# EAGLE board test (EAGLE 5.11)
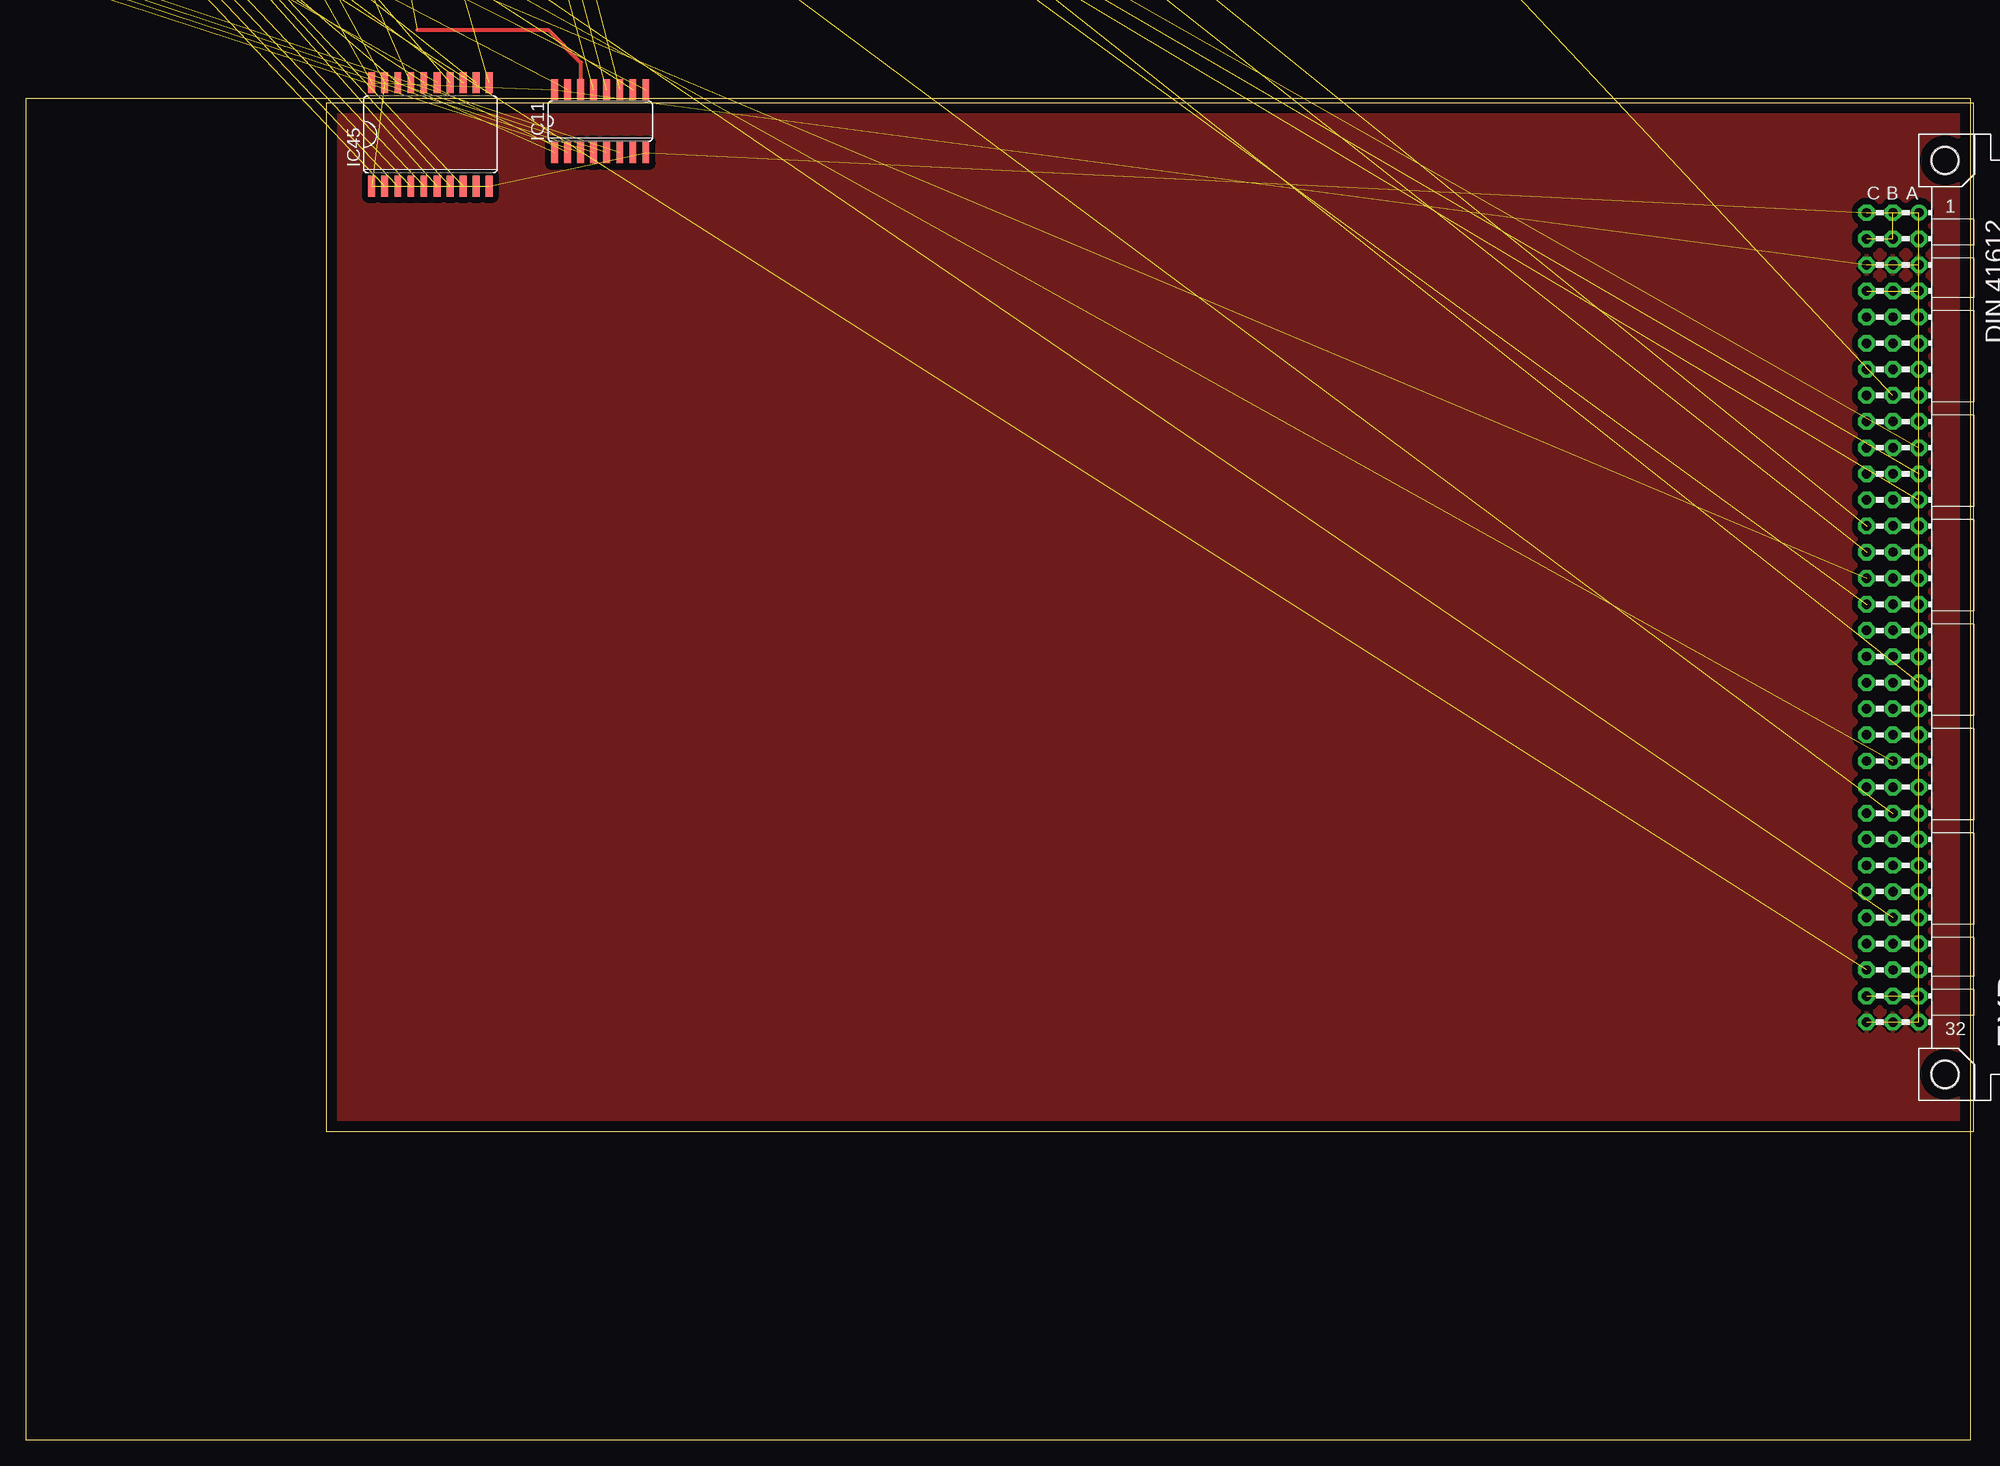
[diagram p10: board, top side]

Size 189.48 x 130.48 mm. Coordinates in mm from the lower left corner, seen from the top.
Outline: 0,0 189.21,0 189.21,130.48 0,130.48 0,0
Copper layers (1*16): Top 0.035mm / dielectric 1.5mm / Bottom 0.035mm
Design rules "default": minimum track width 10mil, minimum drill 24mil, track to track 8mil, track to pad 8mil, pad to pad 8mil, via to via 8mil, smd to smd 8mil, copper to edge 40mil, drill to drill 8mil, minimum pad ring 10mil, minimum via ring 8mil, stop-mask expansion 4mil, vias tented up to drill 0mil, thermal gap 10mil
Net classes: 0 default: width 0.305 mm, clearance 0.203 mm; 1 low power: width 1.27 mm, clearance 0.254 mm; 2 Power Rail: width 0.61 mm, clearance 0.152 mm

## Footprints (pad centres in the part's own frame; a part is rotated, then mirrored left to right if it is on the bottom)
C025-024X044 = drill 0.813 octagon: 1 -1.27,0; 2 1.27,0
E2,5-5 = drill 0.813 pad 1.6 round: + -1.27,0 | drill 0.813 pad 1.6 octagon: - 1.27,0
C0805K = smd 1.3 x 1.6: 1 -1,0; 2 1,0
2X3-NS = drill 1.016 pad 1.88 square: 1 -2.54,-1.27 | drill 1.016 pad 1.88 octagon: 2 -2.54,1.27; 3 0,-1.27; 4 0,1.27; 5 2.54,-1.27; 6 2.54,1.27
DO35-7 = drill 0.813 long: A 3.81,0; C -3.81,0
VG96K = drill 0.914 pad 1.6 round: A1 154.94,39.37 | drill 0.914 pad 1.6 octagon: A2 154.94,36.83; A3 154.94,34.29; A4 154.94,31.75; A5 154.94,29.21; A6 154.94,26.67; A7 154.94,24.13; A8 154.94,21.59; A9 154.94,19.05; A10 154.94,16.51; A11 154.94,13.97; A12 154.94,11.43; A13 154.94,8.89; A14 154.94,6.35; A15 154.94,3.81; A16 154.94,1.27; A17 154.94,-1.27; A18 154.94,-3.81; A19 154.94,-6.35; A20 154.94,-8.89; A21 154.94,-11.43; A22 154.94,-13.97; A23 154.94,-16.51; A24 154.94,-19.05; A25 154.94,-21.59; A26 154.94,-24.13; A27 154.94,-26.67; A28 154.94,-29.21; A29 154.94,-31.75; A30 154.94,-34.29; A31 154.94,-36.83; A32 154.94,-39.37; B1 152.4,39.37; B2 152.4,36.83; B3 152.4,34.29; B4 152.4,31.75; B5 152.4,29.21; B6 152.4,26.67; B7 152.4,24.13; B8 152.4,21.59; B9 152.4,19.05; B10 152.4,16.51; B11 152.4,13.97; B12 152.4,11.43; B13 152.4,8.89; B14 152.4,6.35; B15 152.4,3.81; B16 152.4,1.27; B17 152.4,-1.27; B18 152.4,-3.81; B19 152.4,-6.35; B20 152.4,-8.89; B21 152.4,-11.43; B22 152.4,-13.97; B23 152.4,-16.51; B24 152.4,-19.05; B25 152.4,-21.59; B26 152.4,-24.13; B27 152.4,-26.67; B28 152.4,-29.21; B29 152.4,-31.75; B30 152.4,-34.29; B31 152.4,-36.83; B32 152.4,-39.37; C1 149.86,39.37; C2 149.86,36.83; C3 149.86,34.29; C4 149.86,31.75; C5 149.86,29.21; C6 149.86,26.67; C7 149.86,24.13; C8 149.86,21.59; C9 149.86,19.05; C10 149.86,16.51; C11 149.86,13.97; C12 149.86,11.43; C13 149.86,8.89; C14 149.86,6.35; C15 149.86,3.81; C16 149.86,1.27; C17 149.86,-1.27; C18 149.86,-3.81; C19 149.86,-6.35; C20 149.86,-8.89; C21 149.86,-11.43; C22 149.86,-13.97; C23 149.86,-16.51; C24 149.86,-19.05; C25 149.86,-21.59; C26 149.86,-24.13; C27 149.86,-26.67; C28 149.86,-29.21; C29 149.86,-31.75; C30 149.86,-34.29; C31 149.86,-36.83; C32 149.86,-39.37 | hole 2.794: 157.48,44.45; 157.48,-44.45
SO16 = smd 0.66 x 2.032: 1 -4.445,-3.073; 2 -3.175,-3.073; 3 -1.905,-3.073; 4 -0.635,-3.073; 5 0.635,-3.073; 6 1.905,-3.073; 7 3.175,-3.073; 8 4.445,-3.073; 9 4.445,3.073; 10 3.175,3.073; 11 1.905,3.073; 12 0.635,3.073; 13 -0.635,3.073; 14 -1.905,3.073; 15 -3.175,3.073; 16 -4.445,3.073
SO20W = smd 0.66 x 2.032: 1 -5.715,-5.029; 2 -4.445,-5.029; 3 -3.175,-5.029; 4 -1.905,-5.029; 5 -0.635,-5.029; 6 0.635,-5.029; 7 1.905,-5.029; 8 3.175,-5.029; 9 4.445,-5.029; 10 5.715,-5.029; 11 5.715,5.029; 12 4.445,5.029; 13 3.175,5.029; 14 1.905,5.029; 15 0.635,5.029; 16 -0.635,5.029; 17 -1.905,5.029; 18 -3.175,5.029; 19 -4.445,5.029; 20 -5.715,5.029
SO14 = smd 0.66 x 2.032: 1 -3.81,-3.073; 2 -2.54,-3.073; 3 -1.27,-3.073; 4 0,-3.073; 5 1.27,-3.073; 6 2.54,-3.073; 7 3.81,-3.073; 8 3.81,3.073; 9 2.54,3.073; 10 1.27,3.073; 11 0,3.073; 12 -1.27,3.073; 13 -2.54,3.073; 14 -3.81,3.073
DIL28-3 = drill 0.813 long: 1 -16.51,-3.81; 2 -13.97,-3.81; 3 -11.43,-3.81; 4 -8.89,-3.81; 5 -6.35,-3.81; 6 -3.81,-3.81; 7 -1.27,-3.81; 8 1.27,-3.81; 9 3.81,-3.81; 10 6.35,-3.81; 11 8.89,-3.81; 12 11.43,-3.81; 13 13.97,-3.81; 14 16.51,-3.81; 15 16.51,3.81; 16 13.97,3.81; 17 11.43,3.81; 18 8.89,3.81; 19 6.35,3.81; 20 3.81,3.81; 21 1.27,3.81; 22 -1.27,3.81; 23 -3.81,3.81; 24 -6.35,3.81; 25 -8.89,3.81; 26 -11.43,3.81; 27 -13.97,3.81; 28 -16.51,3.81
MA06-1 = drill 1.016 long: 1 -6.35,0; 2 -3.81,0; 3 -1.27,0; 4 1.27,0; 5 3.81,0; 6 6.35,0
JP2 = drill 0.914 long: 1 -2.54,0; 2 0,0; 3 2.54,0
2,54/1,0 = drill 1.016 pad 2.54 octagon: 1 0,0
PAK100/2500-40 = drill 1 pad 1.422 round: 1 -24.13,-1.27; 2 -24.13,1.27; 3 -21.59,-1.27; 4 -21.59,1.27; 5 -19.05,-1.27; 6 -19.05,1.27; 7 -16.51,-1.27; 8 -16.51,1.27; 9 -13.97,-1.27; 10 -13.97,1.27; 11 -11.43,-1.27; 12 -11.43,1.27; 13 -8.89,-1.27; 14 -8.89,1.27; 15 -6.35,-1.27; 16 -6.35,1.27; 17 -3.81,-1.27; 18 -3.81,1.27; 19 -1.27,-1.27; 20 -1.27,1.27; 21 1.27,-1.27; 22 1.27,1.27; 23 3.81,-1.27; 24 3.81,1.27; 25 6.35,-1.27; 26 6.35,1.27; 27 8.89,-1.27; 28 8.89,1.27; 29 11.43,-1.27; 30 11.43,1.27; 31 13.97,-1.27; 32 13.97,1.27; 33 16.51,-1.27; 34 16.51,1.27; 35 19.05,-1.27; 36 19.05,1.27; 37 21.59,-1.27; 38 21.59,1.27; 39 24.13,-1.27; 40 24.13,1.27
MA05-1 = drill 1.016 long: 1 -5.08,0; 2 -2.54,0; 3 0,0; 4 2.54,0; 5 5.08,0
057-020-1 = drill 1 octagon: 1 -11.43,-1.27; 2 -11.43,1.27; 3 -8.89,-1.27; 4 -8.89,1.27; 5 -6.35,-1.27; 6 -6.35,1.27; 7 -3.81,-1.27; 8 -3.81,1.27; 9 -1.27,-1.27; 10 -1.27,1.27; 11 1.27,-1.27; 12 1.27,1.27; 13 3.81,-1.27; 14 3.81,1.27; 15 6.35,-1.27; 16 6.35,1.27; 17 8.89,-1.27; 18 8.89,1.27; 19 11.43,-1.27; 20 11.43,1.27
PAK100/2500-50 = drill 1 pad 1.422 round: 1 -30.48,-1.27; 2 -30.48,1.27; 3 -27.94,-1.27; 4 -27.94,1.27; 5 -25.4,-1.27; 6 -25.4,1.27; 7 -22.86,-1.27; 8 -22.86,1.27; 9 -20.32,-1.27; 10 -20.32,1.27; 11 -17.78,-1.27; 12 -17.78,1.27; 13 -15.24,-1.27; 14 -15.24,1.27; 15 -12.7,-1.27; 16 -12.7,1.27; 17 -10.16,-1.27; 18 -10.16,1.27; 19 -7.62,-1.27; 20 -7.62,1.27; 21 -5.08,-1.27; 22 -5.08,1.27; 23 -2.54,-1.27; 24 -2.54,1.27; 25 0,-1.27; 26 0,1.27; 27 2.54,-1.27; 28 2.54,1.27; 29 5.08,-1.27; 30 5.08,1.27; 31 7.62,-1.27; 32 7.62,1.27; 33 10.16,-1.27; 34 10.16,1.27; 35 12.7,-1.27; 36 12.7,1.27; 37 15.24,-1.27; 38 15.24,1.27; 39 17.78,-1.27; 40 17.78,1.27; 41 20.32,-1.27; 42 20.32,1.27; 43 22.86,-1.27; 44 22.86,1.27; 45 25.4,-1.27; 46 25.4,1.27; 47 27.94,-1.27; 48 27.94,1.27; 49 30.48,-1.27; 50 30.48,1.27
QS = drill 0.61 long: 1 -2.54,0; 2 2.54,0
0204/7 = drill 0.813 octagon: 1 -3.81,0; 2 3.81,0
SIL9 = drill 0.813 long: 1 -10.16,0; 2 -7.62,0; 3 -5.08,0; 4 -2.54,0; 5 0,0; 6 2.54,0; 7 5.08,0; 8 7.62,0; 9 10.16,0
SIL5 = drill 0.813 long: 1 -5.08,0; 2 -2.54,0; 3 0,0; 4 2.54,0; 5 5.08,0
SIL4 = drill 0.813 long: 1 -3.81,0; 2 -1.27,0; 3 1.27,0; 4 3.81,0
EDG-08 = drill 0.813 long: 1 -8.89,-3.81; 2 -6.35,-3.81; 3 -3.81,-3.81; 4 -1.27,-3.81; 5 1.27,-3.81; 6 3.81,-3.81; 7 6.35,-3.81; 8 8.89,-3.81; 9 8.89,3.81; 10 6.35,3.81; 11 3.81,3.81; 12 1.27,3.81; 13 -1.27,3.81; 14 -3.81,3.81; 15 -6.35,3.81; 16 -8.89,3.81
EDG-04 = drill 0.813 long: 1 -3.81,-3.81; 2 -1.27,-3.81; 3 1.27,-3.81; 4 3.81,-3.81; 5 3.81,3.81; 6 1.27,3.81; 7 -1.27,3.81; 8 -3.81,3.81
EDG-03 = drill 0.813 long: 1 -2.54,-3.81; 2 0,-3.81; 3 2.54,-3.81; 4 2.54,3.81; 5 0,3.81; 6 -2.54,3.81
STANDOFF_28_60 = hole 3.302: 0,0
PAK100/2500-34 = drill 1 pad 1.422 round: 1 -20.32,-1.27; 2 -20.32,1.27; 3 -17.78,-1.27; 4 -17.78,1.27; 5 -15.24,-1.27; 6 -15.24,1.27; 7 -12.7,-1.27; 8 -12.7,1.27; 9 -10.16,-1.27; 10 -10.16,1.27; 11 -7.62,-1.27; 12 -7.62,1.27; 13 -5.08,-1.27; 14 -5.08,1.27; 15 -2.54,-1.27; 16 -2.54,1.27; 17 0,-1.27; 18 0,1.27; 19 2.54,-1.27; 20 2.54,1.27; 21 5.08,-1.27; 22 5.08,1.27; 23 7.62,-1.27; 24 7.62,1.27; 25 10.16,-1.27; 26 10.16,1.27; 27 12.7,-1.27; 28 12.7,1.27; 29 15.24,-1.27; 30 15.24,1.27; 31 17.78,-1.27; 32 17.78,1.27; 33 20.32,-1.27; 34 20.32,1.27
PAK100/2500-5-40 = drill 1 pad 1.422 round: 1 -24.13,-1.27; 2 -24.13,1.27; 3 -21.59,-1.27; 4 -21.59,1.27; 5 -19.05,-1.27; 6 -19.05,1.27; 7 -16.51,-1.27; 8 -16.51,1.27; 9 -13.97,-1.27; 10 -13.97,1.27; 11 -11.43,-1.27; 12 -11.43,1.27; 13 -8.89,-1.27; 14 -8.89,1.27; 15 -6.35,-1.27; 16 -6.35,1.27; 17 -3.81,-1.27; 18 -3.81,1.27; 19 -1.27,-1.27; 20 -1.27,1.27; 21 1.27,-1.27; 22 1.27,1.27; 23 3.81,-1.27; 24 3.81,1.27; 25 6.35,-1.27; 26 6.35,1.27; 27 8.89,-1.27; 28 8.89,1.27; 29 11.43,-1.27; 30 11.43,1.27; 31 13.97,-1.27; 32 13.97,1.27; 33 16.51,-1.27; 34 16.51,1.27; 35 19.05,-1.27; 36 19.05,1.27; 37 21.59,-1.27; 38 21.59,1.27; 39 24.13,-1.27; 40 24.13,1.27

## Placement (x,y rotation side)
$4_37_$  SIGNATURESILK  [SIGNATURE]  -163.83,260.35 0 top  (outside the outline)
$4_39_$  OSHW-LOGOL  [OSHW-LOGO-L]  -86.36,274.32 0 top  (outside the outline)
$4_40_$  QRCODE-CFT  [CFT-QRCODE]  -184.15,31.75 0 top  (outside the outline)
C1  0.1uF  [C025-024X044]  -93.98,274.32 0 top  (outside the outline)
C2  0.1uF  [C025-024X044]  -100.33,274.32 0 top  (outside the outline)
C3  0.1uF  [C025-024X044]  -106.68,274.32 0 top  (outside the outline)
C4  0.1uF  [C025-024X044]  -113.03,274.32 0 top  (outside the outline)
C5  0.1uF  [C025-024X044]  -119.38,274.32 0 top  (outside the outline)
C6  0.1uF  [C025-024X044]  -125.73,274.32 0 top  (outside the outline)
C7  0.1uF  [C025-024X044]  -132.08,274.32 0 top  (outside the outline)
C8  1uF  [C025-024X044]  -170.18,281.94 0 top  (outside the outline)
C9  0.1uF  [C025-024X044]  -138.43,274.32 0 top  (outside the outline)
C10  0.1uF  [C025-024X044]  -144.78,274.32 0 top  (outside the outline)
C11  0.1uF  [C025-024X044]  -151.13,274.32 0 top  (outside the outline)
C12  0.1uF  [C025-024X044]  -157.48,274.32 0 top  (outside the outline)
C17  0.1uF  [C025-024X044]  -163.83,274.32 0 top  (outside the outline)
C18  0.1uF  [C025-024X044]  -170.18,274.32 0 top  (outside the outline)
C19  1uF  [C025-024X044]  -175.26,281.94 0 top  (outside the outline)
C20  0.1uF  [C025-024X044]  -176.53,274.32 0 top  (outside the outline)
C21  0.1uF  [C025-024X044]  -182.88,274.32 0 top  (outside the outline)
C22  0.1uF  [C025-024X044]  -189.23,274.32 0 top  (outside the outline)
C23  0.1uF  [C025-024X044]  -195.58,274.32 0 top  (outside the outline)
C24  0.1uF  [C025-024X044]  -201.93,274.32 0 top  (outside the outline)
C25  0.1uF  [C025-024X044]  -208.28,274.32 0 top  (outside the outline)
C26  0.1uF  [C025-024X044]  -214.63,274.32 0 top  (outside the outline)
C27  0.1uF  [C025-024X044]  12.7,281.94 0 top  (outside the outline)
C28  0.1uF  [C025-024X044]  6.35,281.94 0 top  (outside the outline)
C29  0.1uF  [C025-024X044]  0,281.94 0 top  (outside the outline)
C30  1uF  [C025-024X044]  -180.34,281.94 0 top  (outside the outline)
C31  0.1uF  [C025-024X044]  -6.35,281.94 0 top  (outside the outline)
C32  0.1uF  [C025-024X044]  -12.7,281.94 0 top  (outside the outline)
C33  0.1uF  [C025-024X044]  -19.05,281.94 0 top  (outside the outline)
C34  0.1uF  [C025-024X044]  -25.4,281.94 0 top  (outside the outline)
C35  0.1uF  [C025-024X044]  -31.75,281.94 0 top  (outside the outline)
C36  0.1uF  [C025-024X044]  -38.1,281.94 0 top  (outside the outline)
C37  0.1uF  [C025-024X044]  -44.45,281.94 0 top  (outside the outline)
C38  0.1uF  [C025-024X044]  -50.8,281.94 0 top  (outside the outline)
C39  0.1uF  [C025-024X044]  -57.15,281.94 0 top  (outside the outline)
C40  0.1uF  [C025-024X044]  -63.5,281.94 0 top  (outside the outline)
C41  0.1uF  [C025-024X044]  -69.85,281.94 0 top  (outside the outline)
C42  1uF  [C025-024X044]  -185.42,281.94 0 top  (outside the outline)
C43  0.1uF  [C025-024X044]  -76.2,281.94 0 top  (outside the outline)
C44  0.1uF  [C025-024X044]  -82.55,281.94 0 top  (outside the outline)
C45  0.1uF  [C025-024X044]  -88.9,281.94 0 top  (outside the outline)
C46  1uF  [C025-024X044]  -190.5,281.94 0 top  (outside the outline)
C47  0.1uF  [C025-024X044]  -95.25,281.94 0 top  (outside the outline)
C48  0.1uF  [C025-024X044]  -101.6,281.94 0 top  (outside the outline)
C49  22pF  [C025-024X044]  -158.75,281.94 0 top  (outside the outline)
C50  22pF  [C025-024X044]  -165.1,281.94 0 top  (outside the outline)
C51  0.1uF  [C025-024X044]  -107.95,281.94 0 top  (outside the outline)
C52  0.1uF  [C025-024X044]  -114.3,281.94 0 top  (outside the outline)
C53  0.1uF  [C025-024X044]  -120.65,281.94 0 top  (outside the outline)
C54  1uF  [C025-024X044]  -195.58,281.94 0 top  (outside the outline)
C55  0.1uF  [C025-024X044]  -127,281.94 0 top  (outside the outline)
C56  0.1uF  [C025-024X044]  -133.35,281.94 0 top  (outside the outline)
C57  0.1uF  [C025-024X044]  -139.7,281.94 0 top  (outside the outline)
C58  0.1uF  [C025-024X044]  -146.05,281.94 0 top  (outside the outline)
C59  0.1uF  [C025-024X044]  -152.4,281.94 0 top  (outside the outline)
C60  100uF  [E2,5-5]  -176.53,288.29 0 top  (outside the outline)
C61  1uF  [C0805K]  -115.57,300.99 0 top  (outside the outline)
C62  1uF  [C0805K]  -120.65,300.99 0 top  (outside the outline)
C63  47uF  [E2,5-5]  -186.69,288.29 0 top  (outside the outline)
C64  47uF  [E2,5-5]  -196.85,288.29 0 top  (outside the outline)
CON1  [2X3-NS]  -168.91,262.89 0 top  (outside the outline)
D3  1N4148  [DO35-7]  2.54,288.29 0 top  (outside the outline)
D4  1N4148  [DO35-7]  -10.16,288.29 0 top  (outside the outline)
D5  1N4148  [DO35-7]  -22.86,288.29 0 top  (outside the outline)
D6  1N4148  [DO35-7]  -35.56,288.29 0 top  (outside the outline)
D7  1N4148  [DO35-7]  -48.26,288.29 0 top  (outside the outline)
D16  1N4148  [DO35-7]  -60.96,288.29 0 top  (outside the outline)
D17  1N4148  [DO35-7]  -73.66,288.29 0 top  (outside the outline)
D22  1N4148  [DO35-7]  -86.36,288.29 0 top  (outside the outline)
D23  1N4148  [DO35-7]  -99.06,288.29 0 top  (outside the outline)
D24  1N4148  [DO35-7]  -111.76,288.29 0 top  (outside the outline)
D25  1N4148  [DO35-7]  -124.46,288.29 0 top  (outside the outline)
D26  1N4148  [DO35-7]  -137.16,288.29 0 top  (outside the outline)
D31  1N4148  [DO35-7]  -149.86,288.29 0 top  (outside the outline)
D32  1N4148  [DO35-7]  -162.56,288.29 0 top  (outside the outline)
EXP  [VG96K]  29.21,80.01 0 top
IC1  74HC138D  [SO16]  -162.56,191.77 0 top  (outside the outline)
IC2  74HC541DW  [SO20W]  -179.07,175.26 0 top  (outside the outline)
IC3  74HC541DW  [SO20W]  2.54,191.77 0 top  (outside the outline)
IC4  74HC541DW  [SO20W]  -25.4,191.77 0 top  (outside the outline)
IC5  74HC541DW  [SO20W]  -53.34,191.77 0 top  (outside the outline)
IC6  74HC165D  [SO16]  -185.42,191.77 0 top  (outside the outline)
IC7  74HC165D  [SO16]  5.08,204.47 0 top  (outside the outline)
IC8  74HC165D  [SO16]  -17.78,204.47 0 top  (outside the outline)
IC9  74HC165D  [SO16]  -40.64,204.47 0 top  (outside the outline)
IC10  74HC165D  [SO16]  -63.5,204.47 0 top  (outside the outline)
IC11  74HC165D  [SO16]  55.88,128.27 0 top
IC12  74HC595D  [SO16]  -109.22,204.47 0 top  (outside the outline)
IC13  74HC112D  [SO16]  -132.08,204.47 0 top  (outside the outline)
IC16  74HC165D  [SO16]  -154.94,204.47 0 top  (outside the outline)
IC17  74HC165D  [SO16]  -177.8,204.47 0 top  (outside the outline)
IC18  74HC165D  [SO16]  -200.66,204.47 0 top  (outside the outline)
IC19  74HC165D  [SO16]  5.08,217.17 0 top  (outside the outline)
IC20  74HC165D  [SO16]  -17.78,217.17 0 top  (outside the outline)
IC21  74HC165D  [SO16]  -40.64,217.17 0 top  (outside the outline)
IC22  74HC165D  [SO16]  -63.5,217.17 0 top  (outside the outline)
IC23  74HC165D  [SO16]  -86.36,217.17 0 top  (outside the outline)
IC24  74HC165D  [SO16]  -109.22,217.17 0 top  (outside the outline)
IC25  74HC165D  [SO16]  -132.08,217.17 0 top  (outside the outline)
IC32  74HC595D  [SO16]  -154.94,217.17 0 top  (outside the outline)
IC33  74HC595D  [SO16]  -177.8,217.17 0 top  (outside the outline)
IC35  74HC595D  [SO16]  -200.66,217.17 0 top  (outside the outline)
IC37  74HC85D  [SO16]  5.08,229.87 0 top  (outside the outline)
IC38  74HC74D  [SO14]  -85.09,229.87 0 top  (outside the outline)
IC39  74HC74D  [SO14]  -105.41,229.87 0 top  (outside the outline)
IC40  74HC253D  [SO16]  -17.78,229.87 0 top  (outside the outline)
IC41  MEGA168  [DIL28-3]  -143.51,175.26 0 top  (outside the outline)
IC42  74HC138D  [SO16]  -40.64,229.87 0 top  (outside the outline)
IC43  74HC259D  [SO16]  -63.5,229.87 0 top  (outside the outline)
IC45  74HC540DW  [SO20W]  39.37,127 0 top
IC47  74HC540DW  [SO20W]  -109.22,191.77 0 top  (outside the outline)
IC48  74HC540DW  [SO20W]  -137.16,191.77 0 top  (outside the outline)
JP1  [MA06-1]  -181.61,262.89 0 top  (outside the outline)
JP26  [JP2]  11.43,274.32 0 top  (outside the outline)
JP27  [JP2]  2.54,274.32 0 top  (outside the outline)
JP28  [JP2]  -6.35,274.32 0 top  (outside the outline)
JP29  [JP2]  -15.24,274.32 0 top  (outside the outline)
JP30  [JP2]  -24.13,274.32 0 top  (outside the outline)
JP31  [JP2]  -33.02,274.32 0 top  (outside the outline)
JP32  [JP2]  -41.91,274.32 0 top  (outside the outline)
JP33  [JP2]  -50.8,274.32 0 top  (outside the outline)
JP34  [JP2]  -59.69,274.32 0 top  (outside the outline)
JP35  [JP2]  -68.58,274.32 0 top  (outside the outline)
JP36  [JP2]  -77.47,274.32 0 top  (outside the outline)
NC1  [2,54/1,0]  0,304.8 0 top  (outside the outline)
NC4  [2,54/1,0]  -5.08,304.8 0 top  (outside the outline)
NC9  [2,54/1,0]  -10.16,304.8 0 top  (outside the outline)
NC10  [2,54/1,0]  -127,299.72 0 top  (outside the outline)
NC11  [2,54/1,0]  -133.35,299.72 0 top  (outside the outline)
NC12  [2,54/1,0]  -139.7,299.72 0 top  (outside the outline)
NC13  [2,54/1,0]  -146.05,299.72 0 top  (outside the outline)
NC14  [2,54/1,0]  -152.4,299.72 0 top  (outside the outline)
NC15  [2,54/1,0]  -158.75,299.72 0 top  (outside the outline)
NC16  [2,54/1,0]  -165.1,299.72 0 top  (outside the outline)
NC17  [2,54/1,0]  -171.45,299.72 0 top  (outside the outline)
NC18  [2,54/1,0]  -177.8,299.72 0 top  (outside the outline)
NC19  [2,54/1,0]  -184.15,299.72 0 top  (outside the outline)
NC20  [2,54/1,0]  -190.5,299.72 0 top  (outside the outline)
NC21  [2,54/1,0]  -196.85,299.72 0 top  (outside the outline)
NC22  [2,54/1,0]  -203.2,299.72 0 top  (outside the outline)
NC23  [2,54/1,0]  -209.55,299.72 0 top  (outside the outline)
NC24  [2,54/1,0]  -215.9,299.72 0 top  (outside the outline)
NC25  [2,54/1,0]  11.43,304.8 0 top  (outside the outline)
NC26  [2,54/1,0]  5.08,304.8 0 top  (outside the outline)
P4  2540-  [PAK100/2500-40]  -85.09,252.73 0 top  (outside the outline)
P5  2540-  [PAK100/2500-40]  -144.78,252.73 0 top  (outside the outline)
P6  2540-  [PAK100/2500-40]  -12.7,264.16 0 top  (outside the outline)
P7  2540-  [PAK100/2500-40]  -72.39,264.16 0 top  (outside the outline)
P8  [MA05-1]  -196.85,262.89 0 top  (outside the outline)
P9  057-020-1  [057-020-1]  -59.69,176.53 0 top  (outside the outline)
P10  2550-  [PAK100/2500-50]  -152.4,228.6 0 top  (outside the outline)
P11  2550-  [PAK100/2500-50]  -19.05,241.3 0 top  (outside the outline)
P12  2550-  [PAK100/2500-50]  -91.44,241.3 0 top  (outside the outline)
P13  2550-  [PAK100/2500-50]  -163.83,241.3 0 top  (outside the outline)
P14  2550-  [PAK100/2500-50]  -19.05,252.73 0 top  (outside the outline)
Q2  [QS]  -209.55,261.62 0 top  (outside the outline)
R1  30R  [0204/7]  -17.78,304.8 0 top  (outside the outline)
R2  30R  [0204/7]  -27.94,304.8 0 top  (outside the outline)
R3  4k7  [0204/7]  -38.1,304.8 0 top  (outside the outline)
R4  4k7  [0204/7]  -48.26,304.8 0 top  (outside the outline)
R5  4k7  [0204/7]  -58.42,304.8 0 top  (outside the outline)
R6  4k7  [0204/7]  -68.58,304.8 0 top  (outside the outline)
R7  30R  [0204/7]  -78.74,304.8 0 top  (outside the outline)
R8  4k7  [0204/7]  -88.9,304.8 0 top  (outside the outline)
R9  30R  [0204/7]  -99.06,304.8 0 top  (outside the outline)
R10  30R  [0204/7]  -109.22,304.8 0 top  (outside the outline)
R11  30R  [0204/7]  -119.38,304.8 0 top  (outside the outline)
R12  30R  [0204/7]  -129.54,304.8 0 top  (outside the outline)
R13  30R  [0204/7]  -139.7,304.8 0 top  (outside the outline)
R14  30R  [0204/7]  -149.86,304.8 0 top  (outside the outline)
R15  30R  [0204/7]  -160.02,304.8 0 top  (outside the outline)
R16  30R  [0204/7]  -170.18,304.8 0 top  (outside the outline)
R17  30R  [0204/7]  -180.34,304.8 0 top  (outside the outline)
R18  30R  [0204/7]  -190.5,304.8 0 top  (outside the outline)
R19  30R  [0204/7]  -200.66,304.8 0 top  (outside the outline)
R20  30R  [0204/7]  -210.82,304.8 0 top  (outside the outline)
R21  30R  [0204/7]  11.43,309.88 0 top  (outside the outline)
R22  4k7  [0204/7]  1.27,309.88 0 top  (outside the outline)
R23  30R  [0204/7]  -8.89,309.88 0 top  (outside the outline)
R24  30R  [0204/7]  -19.05,309.88 0 top  (outside the outline)
R25  30R  [0204/7]  -29.21,309.88 0 top  (outside the outline)
R26  30R  [0204/7]  -39.37,309.88 0 top  (outside the outline)
R27  30R  [0204/7]  -49.53,309.88 0 top  (outside the outline)
R28  30R  [0204/7]  -59.69,309.88 0 top  (outside the outline)
R29  30R  [0204/7]  -69.85,309.88 0 top  (outside the outline)
R30  30R  [0204/7]  -80.01,309.88 0 top  (outside the outline)
R31  30R  [0204/7]  -90.17,309.88 0 top  (outside the outline)
R32  30R  [0204/7]  -100.33,309.88 0 top  (outside the outline)
R33  30R  [0204/7]  -110.49,309.88 0 top  (outside the outline)
R37  30R  [0204/7]  -120.65,309.88 0 top  (outside the outline)
R38  30R  [0204/7]  -130.81,309.88 0 top  (outside the outline)
RN1  4k7  [SIL9]  3.81,294.64 0 top  (outside the outline)
RN2  4k7  [SIL9]  -21.59,294.64 0 top  (outside the outline)
RN3  4k7  [SIL9]  -46.99,294.64 0 top  (outside the outline)
RN4  4k7  [SIL9]  -72.39,294.64 0 top  (outside the outline)
RN5  4k7  [SIL9]  -97.79,294.64 0 top  (outside the outline)
RN6  4k7  [SIL9]  -123.19,294.64 0 top  (outside the outline)
RN7  4k7  [SIL9]  -148.59,294.64 0 top  (outside the outline)
RN9  4k7  [SIL9]  -173.99,294.64 0 top  (outside the outline)
RN10  4k7  [SIL9]  -199.39,294.64 0 top  (outside the outline)
RN11  4k7  [SIL5]  -92.71,299.72 0 top  (outside the outline)
RN13  4k7  [SIL9]  3.81,299.72 0 top  (outside the outline)
RN14  4k7  [SIL9]  -21.59,299.72 0 top  (outside the outline)
RN18  4k7  [SIL4]  -106.68,299.72 0 top  (outside the outline)
RN19  4k7  [SIL9]  -46.99,299.72 0 top  (outside the outline)
RN20  4k7  [SIL9]  -72.39,299.72 0 top  (outside the outline)
SW1  [EDG-08]  -88.9,175.26 0 top  (outside the outline)
SW2  [EDG-04]  -107.95,175.26 0 top  (outside the outline)
SW3  [EDG-03]  -119.38,175.26 0 top  (outside the outline)
U1  HOLE  [STANDOFF_28_60]  -201.93,281.94 0 top  (outside the outline)
U2  HOLE  [STANDOFF_28_60]  -208.28,281.94 0 top  (outside the outline)
U3  HOLE  [STANDOFF_28_60]  -214.63,281.94 0 top  (outside the outline)
U4  HOLE  [STANDOFF_28_60]  12.7,288.29 0 top  (outside the outline)
X1  2534-  [PAK100/2500-34]  -128.27,264.16 0 top  (outside the outline)
X4  2540-5  [PAK100/2500-5-40]  -12.7,173.99 0 top  (outside the outline)

## Tracks (layer width: path | path; a pad name or v marks a point on that pad's centre or on a via)
!AB-OE  (3 unrouted)
!CB-WEN  (1 unrouted)
!CLR  (7 unrouted)
!CTL-OE  (5 unrouted)
!DB-OE  (3 unrouted)
!DEBEN  (7 unrouted)
!FPRAM  (1 unrouted)
!FPRESET  (1 unrouted)
!HALT  (1 unrouted)
!IBUS-OE  (3 unrouted)
!IO  (1 unrouted)
!IODEV1XX  (1 unrouted)
!MEM  (1 unrouted)
!MFD-DR  (2 unrouted)
!MFD-OR  (2 unrouted)
!MFD-UADDR  (2 unrouted)
!PB0-AINDEX  (2 unrouted)
!PB0-CLI  (1 unrouted)
!PB0-CLL  (1 unrouted)
!PB0-CPL  (1 unrouted)
!PB0-DEC  (1 unrouted)
!PB0-END  (1 unrouted)
!PB0-INCPC  (1 unrouted)
!PB0-IO  (1 unrouted)
!PB0-IRQSUC  (3 unrouted)
!PB0-MEM  (1 unrouted)
!PB0-R  (1 unrouted)
!PB0-RSTHOLD  (3 unrouted)
!PB0-SKIP  (2 unrouted)
!PB0-STI  (1 unrouted)
!PB0-STPAC  (1 unrouted)
!PB0-STPDR  (1 unrouted)
!PB0-WEN  (1 unrouted)
!PFP-SEL  (2 unrouted)
!R  (2 unrouted)
!RESET  (4 unrouted)
!RESET-MCU  (2 unrouted)
!RSTHOLD  (2 unrouted)
!SAMPLE  (18 unrouted)
!SWFAST  (2 unrouted)
!SWIFR1  (2 unrouted)
  Top 0.406: IC11.14 53.98,133.98 50.8,137.16 38.1,137.16
!SWIFR6  (2 unrouted)
!SWINC  (2 unrouted)
!SWIOR  (2 unrouted)
!SWIOW  (2 unrouted)
!SWLDAC  (2 unrouted)
!SWLDADDR  (2 unrouted)
!SWLDIR  (2 unrouted)
!SWLEDSON  (12 unrouted)
!SWMEMR  (2 unrouted)
!SWMEMW  (2 unrouted)
!SWMFD0  (1 unrouted)
!SWMFD1  (1 unrouted)
!SWPOWER  (1 unrouted)
!SWRAM  (2 unrouted)
!SWRESET  (2 unrouted)
!SWRUN  (2 unrouted)
!SWSLOW  (2 unrouted)
!SWSPARE  (2 unrouted)
!SWSTEP  (2 unrouted)
!SWSTOP  (2 unrouted)
!SWUSTEP  (2 unrouted)
!USTEP  (1 unrouted)
!VPEN  (10 unrouted)
!W  (1 unrouted)
!WAIT  (4 unrouted)
!WS  (1 unrouted)
+3.3V  (2 unrouted)
+5V  (1 unrouted)
AB5  (1 unrouted)
AB6  (1 unrouted)
AB7  (1 unrouted)
BAEXT0  (1 unrouted)
BAEXT1  (1 unrouted)
BAEXT2  (1 unrouted)
BAEXT3  (1 unrouted)
BAEXT4  (1 unrouted)
BAEXT5  (1 unrouted)
BAEXT6  (1 unrouted)
BAEXT7  (1 unrouted)
BFIRQ  (2 unrouted)
BFNEG  (2 unrouted)
BFZERO  (2 unrouted)
CLI  (2 unrouted)
CLK4  (1 unrouted)
CLL  (2 unrouted)
CLR-WS  (2 unrouted)
CMD0  (2 unrouted)
CMD1  (2 unrouted)
COUT  (3 unrouted)
CPL  (2 unrouted)
CTLCLK  (2 unrouted)
DEB-CASCADE  (1 unrouted)
DEB-IN-BOARD2  (3 unrouted)
DEC  (2 unrouted)
DOUT  (4 unrouted)
DR0  (2 unrouted)
DR1  (2 unrouted)
DR2  (2 unrouted)
DR3  (2 unrouted)
DR4  (2 unrouted)
DR5  (2 unrouted)
DR6  (2 unrouted)
DR7  (2 unrouted)
DR8  (2 unrouted)
DR9  (2 unrouted)
DR10  (2 unrouted)
DR11  (2 unrouted)
DR12  (2 unrouted)
DR13  (2 unrouted)
DR14  (2 unrouted)
DR15  (2 unrouted)
END  (2 unrouted)
FPAC0  (2 unrouted)
FPAC1  (2 unrouted)
FPAC2  (2 unrouted)
FPAC3  (2 unrouted)
FPAC4  (2 unrouted)
FPAC5  (2 unrouted)
FPAC6  (2 unrouted)
FPAC7  (2 unrouted)
FPAC8  (2 unrouted)
FPAC9  (2 unrouted)
FPAC10  (2 unrouted)
FPAC11  (2 unrouted)
FPAC12  (2 unrouted)
FPAC13  (2 unrouted)
FPAC14  (2 unrouted)
FPAC15  (2 unrouted)
FPCLKEN  (1 unrouted)
FPCLKEN-IN  (4 unrouted)
FPEXEC  (3 unrouted)
FPFETCH  (2 unrouted)
FPFL  (4 unrouted)
FPINT  (1 unrouted)
FPIR0  (2 unrouted)
FPIR1  (2 unrouted)
FPIR2  (2 unrouted)
FPIR3  (2 unrouted)
FPIR4  (2 unrouted)
FPIR5  (2 unrouted)
FPIR6  (2 unrouted)
FPIR7  (2 unrouted)
FPIR8  (2 unrouted)
FPIR9  (2 unrouted)
FPIR10  (2 unrouted)
FPIR11  (4 unrouted)
FPIR12  (4 unrouted)
FPIR13  (4 unrouted)
FPIR14  (4 unrouted)
FPIR15  (4 unrouted)
FPOPIF0  (2 unrouted)
FPPC0  (2 unrouted)
FPPC1  (2 unrouted)
FPPC2  (2 unrouted)
FPPC3  (2 unrouted)
FPPC4  (2 unrouted)
FPPC5  (2 unrouted)
FPPC6  (2 unrouted)
FPPC7  (2 unrouted)
FPPC8  (2 unrouted)
FPPC9  (2 unrouted)
FPPC10  (2 unrouted)
FPPC11  (2 unrouted)
FPPC12  (2 unrouted)
FPPC13  (2 unrouted)
FPPC14  (2 unrouted)
FPPC15  (2 unrouted)
FPRST  (1 unrouted)
FPRUN  (1 unrouted)
FPSTOP  (1 unrouted)
FPUSTEP  (1 unrouted)
FPUSTEP-IN  (4 unrouted)
FPWS  (2 unrouted)
GND  (205 unrouted)
ICLK  (18 unrouted)
INCPC  (2 unrouted)
IO  (2 unrouted)
IOADDR0  (3 unrouted)
IOADDR1  (3 unrouted)
IOADDR2  (3 unrouted)
IOCMD  (3 unrouted)
MBEN  (1 unrouted)
MEM  (2 unrouted)
MFD0  (3 unrouted)
MFD1  (3 unrouted)
MFD2  (3 unrouted)
MFD3  (3 unrouted)
MFD4  (3 unrouted)
MFD5  (3 unrouted)
MFD6  (3 unrouted)
MFD7  (3 unrouted)
MFD8  (3 unrouted)
MFD9  (3 unrouted)
MFD10  (3 unrouted)
MFD11  (3 unrouted)
MFD12  (3 unrouted)
MFD13  (3 unrouted)
MFD14  (3 unrouted)
MFD15  (3 unrouted)
MISO  (2 unrouted)
MOSI  (2 unrouted)
N$1  (1 unrouted)
N$2  (1 unrouted)
N$3  (1 unrouted)
N$4  (1 unrouted)
N$5  (1 unrouted)
N$6  (1 unrouted)
N$7  (1 unrouted)
N$8  (1 unrouted)
N$9  (1 unrouted)
N$10  (1 unrouted)
N$11  (1 unrouted)
N$12  (1 unrouted)
N$13  (1 unrouted)
N$14  (1 unrouted)
N$15  (1 unrouted)
N$16  (1 unrouted)
N$17  (1 unrouted)
N$18  (1 unrouted)
N$19  (1 unrouted)
N$20  (1 unrouted)
N$21  (1 unrouted)
N$22  (1 unrouted)
N$23  (1 unrouted)
N$24  (1 unrouted)
N$38  (1 unrouted)
N$39  (1 unrouted)
N$40  (2 unrouted)
N$41  (2 unrouted)
N$42  (1 unrouted)
N$43  (1 unrouted)
N$44  (1 unrouted)
N$45  (1 unrouted)
N$63  (1 unrouted)
N$65  (1 unrouted)
N$66  (1 unrouted)
N$67  (1 unrouted)
N$68  (1 unrouted)
N$69  (1 unrouted)
N$70  (1 unrouted)
N$72  (1 unrouted)
N$73  (1 unrouted)
N$74  (1 unrouted)
N$75  (1 unrouted)
N$76  (1 unrouted)
N$78  (1 unrouted)
N$79  (1 unrouted)
N$80  (1 unrouted)
N$81  (1 unrouted)
N$82  (6 unrouted)
N$83  (2 unrouted)
N$86  (2 unrouted)
N$89  (2 unrouted)
N$91  (2 unrouted)
N$93  (6 unrouted)
N$94  (2 unrouted)
N$95  (2 unrouted)
N$96  (2 unrouted)
N$97  (4 unrouted)
N$98  (4 unrouted)
N$99  (6 unrouted)
N$100  (1 unrouted)
N$101  (1 unrouted)
N$102  (2 unrouted)
N$103  (2 unrouted)
N$104  (2 unrouted)
N$105  (1 unrouted)
N$106  (1 unrouted)
N$107  (1 unrouted)
N$108  (2 unrouted)
N$109  (2 unrouted)
N$110  (1 unrouted)
N$111  (1 unrouted)
N$112  (1 unrouted)
N$113  (1 unrouted)
N$114  (1 unrouted)
N$115  (1 unrouted)
N$116  (1 unrouted)
N$117  (1 unrouted)
N$118  (1 unrouted)
N$119  (1 unrouted)
N$120  (1 unrouted)
N$121  (1 unrouted)
N$122  (1 unrouted)
N$123  (1 unrouted)
N$124  (1 unrouted)
N$125  (1 unrouted)
N$126  (1 unrouted)
N$127  (1 unrouted)
N$128  (1 unrouted)
N$129  (1 unrouted)
N$130  (1 unrouted)
N$131  (1 unrouted)
N$132  (1 unrouted)
N$133  (1 unrouted)
N$134  (1 unrouted)
N$135  (1 unrouted)
N$136  (1 unrouted)
N$137  (1 unrouted)
N$138  (1 unrouted)
N$139  (1 unrouted)
N$141  (1 unrouted)
N$142  (1 unrouted)
N$143  (1 unrouted)
N$144  (1 unrouted)
N$145  (2 unrouted)
N$146  (2 unrouted)
N$147  (1 unrouted)
N$148  (2 unrouted)
N$149  (2 unrouted)
N$150  (2 unrouted)
N$151  (2 unrouted)
N$152  (2 unrouted)
N$153  (2 unrouted)
N$154  (1 unrouted)
N$156  (1 unrouted)
N$158  (2 unrouted)
N$174  (1 unrouted)
N$175  (1 unrouted)
N$176  (1 unrouted)
N$177  (1 unrouted)
N$178  (1 unrouted)
N$179  (1 unrouted)
N$180  (1 unrouted)
N$181  (1 unrouted)
N$182  (1 unrouted)
N$183  (1 unrouted)
N$184  (1 unrouted)
N$185  (1 unrouted)
N$186  (1 unrouted)
N$187  (1 unrouted)
N$188  (1 unrouted)
N$189  (1 unrouted)
N$190  (1 unrouted)
N$191  (1 unrouted)
N$192  (1 unrouted)
N$193  (1 unrouted)
N$194  (1 unrouted)
N$195  (1 unrouted)
N$196  (1 unrouted)
N$197  (1 unrouted)
N$198  (1 unrouted)
N$199  (1 unrouted)
ORCLK  (2 unrouted)
PB0-FV  (4 unrouted)
PB0-OPIF1  (2 unrouted)
PB0-OPIF2  (2 unrouted)
PB0-OPIF3  (2 unrouted)
PB0-RUNIT0  (2 unrouted)
PB0-RUNIT1  (2 unrouted)
PB0-RUNIT2  (2 unrouted)
PB0-RUNIT3  (2 unrouted)
PB0-UCB0  (1 unrouted)
PB0-UCB1  (1 unrouted)
PB0-UCB2  (1 unrouted)
PB0-UCB3  (1 unrouted)
POWEROK  (1 unrouted)
R  (1 unrouted)
RESETTING  (2 unrouted)
RXD  (1 unrouted)
SCK  (2 unrouted)
SEROUT  (2 unrouted)
SR0  (2 unrouted)
SR1  (2 unrouted)
SR2  (2 unrouted)
SR3  (2 unrouted)
SR4  (2 unrouted)
SR5  (2 unrouted)
SR6  (2 unrouted)
SR7  (2 unrouted)
SR8  (2 unrouted)
SR9  (2 unrouted)
SR10  (2 unrouted)
SR11  (2 unrouted)
SR12  (2 unrouted)
SR13  (2 unrouted)
SR14  (2 unrouted)
SR15  (2 unrouted)
STCP  (5 unrouted)
STEP/!RUN  (1 unrouted)
STEPPING  (1 unrouted)
STI  (2 unrouted)
STPAC  (2 unrouted)
STPDR  (2 unrouted)
SWLOCK  (2 unrouted)
TXD  (1 unrouted)
UPC0  (3 unrouted)
UPC1  (3 unrouted)
UPC2  (3 unrouted)
UPC3  (3 unrouted)
USTEPPING  (1 unrouted)
VCC  (126 unrouted)
  pour Top (isolate 0.635): 0,130.81 189.23,130.81 189.23,0 0,0
VPIN  (2 unrouted)
WEN  (1 unrouted)
WUNIT0  (2 unrouted)
WUNIT1  (2 unrouted)
WUNIT2  (2 unrouted)